# Altium schematic sheet PMIC.SchDoc
size A4; SheetNumber: 3; SheetTotal: 3
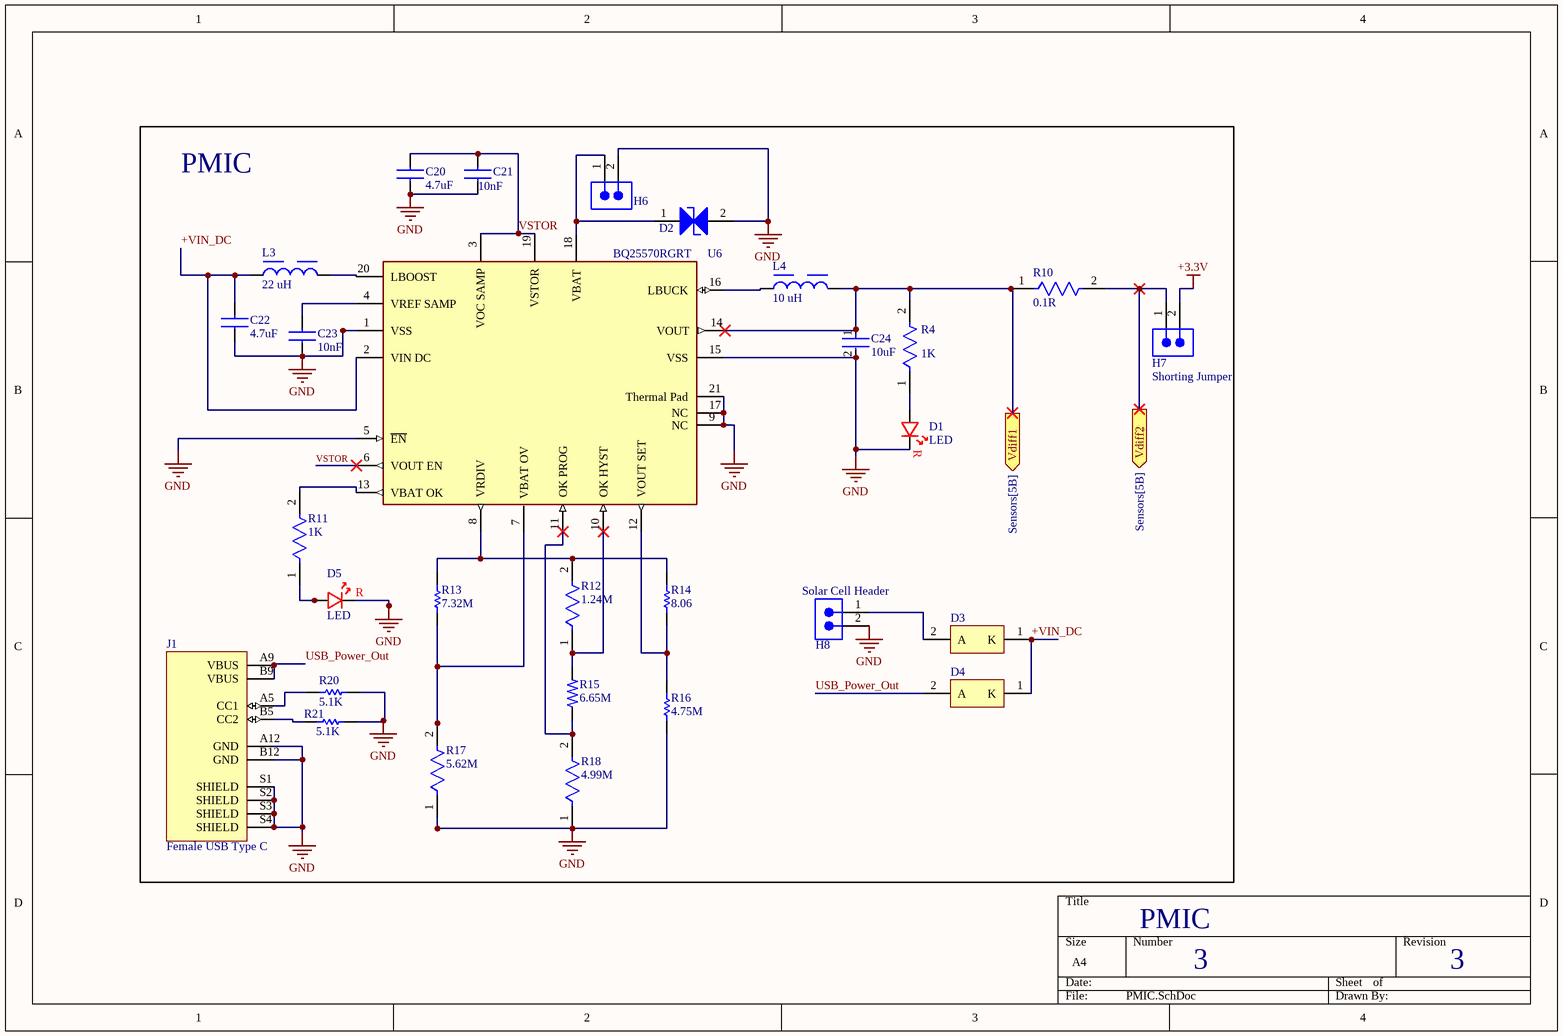
[diagram p0: PMIC.SchDoc]

## Parts
C20  4.7uF  [Cap_0603_4,7uf]
C21  10nF  [Cap_0603_10nF]
C22  4.7uF  [Cap_0603_4,7uf]
C23  10nF  [Cap_0603_10nF]
C24  10uF  [FP-GRM188-0_1-e0_2_0_55-IPC_A]
D1  LED  [LED_RED_1.6X0.8]
D2  824032815  [WE-TVS_DFN1610-2L]  (value not drawn)
D3  MBR120VLSFT1G  [ONSC-SOD-123FL-2-498-01_V]  (value not drawn)
D4  MBR120VLSFT1G  [ONSC-SOD-123FL-2-498-01_V]  (value not drawn)
D5  LED  [LED_RED_1.6X0.8]
H6  JST2PH  [JST_B2B-PH-K-S(LF)(SN)]  (value not drawn)
H7  Shorting Jumper  [2-PIN_MALE_HEADER_01-IN]
H8  Solar Cell Header  [2-PIN_MALE_HEADER_01-IN]
J1  Female USB Type C  [GCT_USB4125-GF-A_REVA2]
L3  22 uH  [WE-TPC_3816]
L4  10 uH  [WE-TPC_2813]
R4  1K  [FP-RMCF0805-IPC_C]
R10  0.1R  [FP-ERJ3R-MFG]
R11  1K  [FP-RMCF0805-IPC_C]
R12  1.24M  [FP-CRCW0805-e3-IPC_A]
R13  7.32M  [RESC0603(1608)_N]
R14  8.06  [RESC1609X50X30ML10T20]
R15  6.65M  [R_0603_6.65M]
R16  4.75M  [RESC1608X55X25ML10T15]
R17  5.62M  [FP-CRCW0603-e3-IPC_B]
R18  4.99M  [FP-AC0603-IPC_C]
R20  5.1K  [RESC1608X55X25ML10T15]
R21  5.1K  [RESC1608X55X25ML10T15]
U6  BQ25570RGRT  [BQ25570]

## Blocks framed on the sheet
PMIC: C20-C24 D1-D5 H6-H8 J1 L3 L4 R4 R10-R18 R20 R21 U6

## Ports
Vdiff1 (out, see Sensors[5B]), Vdiff2 (out, see Sensors[5B])

## Nets
+3.3V: H7.2
GND: C20.1 C21.1 C22.2 C23.2 C24.2 D1.C D2.2(GND) D5.C H6.2 H8.2 J1.A12(GND) J1.B12(GND) J1.S1(SHIELD) J1.S2(SHIELD) J1.S3(SHIELD) J1.S4(SHIELD) R16.1 R17.1 R18.1 R20.2 R21.2 U6.1(VSS) U6.5(~{EN}) U6.9(NC) U6.15(VSS) U6.17(NC) U6.21(Thermal_Pad)
+VIN_DC: C22.1 D3.1(K) D4.1(K) L3.1 U6.2(VIN_DC)
USB_Power_Out: D4.2(A) J1.A9(VBUS) J1.B9(VBUS)
Vdiff1: C24.1 L4.2 R4.2 R10.1 U6.14(VOUT) ; port Vdiff1
Vdiff2: H7.1 R10.2 ; port Vdiff2
VSTOR: C20.2 C21.2 U6.3(VOC_SAMP) U6.6(VOUT_EN) U6.19(VSTOR)
NetC23_1: C23.1 U6.4(VREF_SAMP)
NetD1_A: D1.A R4.1
NetD2_1: D2.1(I/O_1) H6.1 U6.18(VBAT)
NetD3_2: D3.2(A) H8.1
NetD5_A: D5.A R11.1
NetJ1_A5: J1.A5(CC1) R20.1
NetJ1_B5: J1.B5(CC2) R21.1
NetL3_2: L3.2 U6.20(LBOOST)
NetL4_1: L4.1 U6.16(LBUCK)
NetR11_2: R11.2 U6.13(VBAT_OK)
NetR12_1: R12.1 R15.2 U6.10(OK_HYST)
NetR12_2: R12.2 R13.2 R14.2 U6.8(VRDIV)
NetR13_1: R13.1 R17.2 U6.7(VBAT_OV)
NetR14_1: R14.1 R16.2 U6.12(VOUT_SET)
NetR15_1: R15.1 R18.2 U6.11(OK_PROG)

## Notes on the sheet
- PMIC
- 3
- (in symbol LED_1.6x0.8) R

## Library data of the parts
C20 C22 = Cap_0603_4.7uf: Ceramic Capacitor, Multilayer, Ceramic, 10V, 10% +Tol, 10% -Tol, X5R, 15% TC, 4.7uF, Surface Mount, 0603; Manufacturer: Samsung; Manufacturer Part Number: CL10A475KP8NNNC; Multilayer: Yes; Supplier: Digikey; Supplier Part Number: 1276-1044-1-ND; RoHS: Yes; Category: Ceramic Capacitors; Stock: 6782478; Pricing: 1=0.1, 10=0.041, 50=0.0234, 100=0.0182, 500=0.01368, 1000=0.01075, 4000=0.00899, 8000=0.00821, 12000=0.00782, 28000=0.00743, 100000=0.00537, 200000=0.0052, 400000=0.00489 (USD); Mounting Technology: Surface Mount; Pins: 2; Dielectric Material: Ceramic; Package Shape: Rectangular; Case/Package: 0603; Terminal Finish: Nickel; Min Operating Temperature: -55°C; Max Operating Temperature: 85°C; JESD-609 Code: e3; Value: 4.7uF; Capacitor Type: Ceramic; Tolerance  (fill in as +-): 10%; Package Style: SMTMeter; Packaging: Tape and Reel; Tolerance (fill in as +-): 10%; Rated DC Voltage (URdc): 10V; Temperature Characteristics Code: X5R; Termination: Wraparound; Length: 1.6mm; Width: 0.8mm; Height: 0.5mm; Reach SVHC Compliant: Yes; RoHS Compliant: Yes; ComponentLink1URL: https://datasheet.ciiva.com:443/pdfs/VipMasterIC/IC/SEMS/SEMS-S-A0008521003/SEMS-S-A0008520862-1.pdf?src-supplier=IHS+Markit; ComponentLink1Description: https://datasheet.ciiva.com:443/pdfs/VipMasterIC/IC/SEMS/SEMS-S-A0008521003/SEMS-S-A0008520862-1.pdf?src-supplier=IHS+Markit; ComponentLink2URL: https://datasheet.ciiva.com/25797/cl10a475kp8nnnc-25797520.pdf?src-supplier=Digikey; ComponentLink2Description: https://datasheet.ciiva.com/25797/cl10a475kp8nnnc-25797520.pdf?src-supplier=Digikey; ComponentLink3URL: https://datasheet.ciiva.com/26838/getdatasheetpartid-358676-26838384.pdf?src-supplier=Verical; ComponentLink3Description: https://datasheet.ciiva.com/26838/getdatasheetpartid-358676-26838384.pdf?src-supplier=Verical; ComponentLink4URL: https://datasheet.ciiva.com/16318/cl05b104kq5nnnc-16318245.pdf?src-supplier=Future+Electronics; ComponentLink4Description: https://datasheet.ciiva.com/16318/cl05b104kq5nnnc-16318245.pdf?src-supplier=Future+Electronics
C21 C23 = Cap_0603_10nF: Cap Cer 10NF 16V X7R 0603; Manufacturer: Samsung; Manufacturer Part Number: CL10B103KO8WPNC; Supplier: Digikey; Supplier Part Number: 1276-CL10B103KO8WPNCCT-ND; RoHS: No; Category: Ceramic Capacitors; Stock: 44818; Pricing: 1=0.1, 10=0.041, 50=0.0278, 100=0.0238, 500=0.01708, 1000=0.015 (USD)
C24 = CMP-2006-02792-2: Chip Multilayer Ceramic Capacitors for General Purpose, 0603, 10uF, X5R, 15%, 20%, 6.3V; Manufacturer: Murata; Manufacturer Part Number: GRM188R60J106ME47D; Multilayer: Yes; Packaging: Tape and Reel; Voltage Rating (DC): 6.3V; Width: 0.031inch; Termination: SMD/SMT; Dielectric: X5R; Package Quantity: 4000; Voltage Rating: 6.3V; Capacitance: 10uF; Case/Package: 0603; Min Operating Temperature: -55°C; Voltage: 6.3V; Length: 1.6mm; Thickness: 0.035inch; Lead Free: Lead Free; Depth: 0.8mm; Case Code (Imperial): 0603; Max Operating Temperature: 85°C; Material: Ceramic; Height: 0.8mm; Tolerance: 20%; Mount: Surface Mount; REACH SVHC: No SVHC; Radiation Hardening: No; Case Code (Metric): 1608; Supplier: Digikey; Supplier Part Number: 490-3896-1-ND; RoHS: Yes; Category: Ceramic Capacitors; Stock: 815910; Pricing: 1=0.15, 10=0.085, 50=0.059, 100=0.051, 500=0.03764, 1000=0.03346, 4000=0.02717, 8000=0.02481, 12000=0.02363, 20000=0.02231, 28000=0.02153, 40000=0.02079, 100000=0.01917, 200000=0.01819, 400000=0.01738 (USD); Mounting Technology: Surface Mount; Pins: 2; Dielectric Material: Ceramic; Package Shape: Rectangular; Terminal Finish: Nickel; JESD-609 Code: e3; Value: 10uF; Capacitor Type: Ceramic; Tolerance  (fill in as +-): 20%; Package Style: SMTMeter; Tolerance (fill in as +-): 20%; Rated DC Voltage (URdc): 6.3V; Temperature Characteristics Code: X5R; Reach SVHC Compliant: Yes; RoHS Compliant: Yes; ComponentLink1URL: https://datasheet.ciiva.com:443/pdfs/VipMasterIC/IC/MURE/MURE-S-A0008911298/MURE-S-A0008911290-1.pdf?src-supplier=IHS+Markit; ComponentLink1Description: https://datasheet.ciiva.com:443/pdfs/VipMasterIC/IC/MURE/MURE-S-A0008911298/MURE-S-A0008911290-1.pdf?src-supplier=IHS+Markit; ComponentLink2URL: https://datasheet.ciiva.com/22776/1747457-22776418.pdf?src-supplier=Farnell; ComponentLink2Description: https://datasheet.ciiva.com/22776/1747457-22776418.pdf?src-supplier=Farnell; ComponentLink3URL: https://datasheet.ciiva.com/29199/454401-da-01-en-vs-kondensator-0603-29199677.pdf?src-supplier=Conrad; ComponentLink3Description: https://datasheet.ciiva.com/29199/454401-da-01-en-vs-kondensator-0603-29199677.pdf?src-supplier=Conrad; ComponentLink4URL: https://datasheet.ciiva.com/29202/450781-da-01-de-vs-chip-kond-0603-10-0-uf-20pr-6-3v-x5r-29202806.pdf?src-supplier=Conrad; ComponentLink4Description: https://datasheet.ciiva.com/29202/450781-da-01-de-vs-chip-kond-0603-10-0-uf-20pr-6-3v-x5r-29202806.pdf?src-supplier=Conrad; ComponentLink5URL: https://datasheet.ciiva.com/138/partnumbering-e-01-138658.pdf?src-supplier=Digikey; ComponentLink5Description: https://datasheet.ciiva.com/138/partnumbering-e-01-138658.pdf?src-supplier=Digikey; ComponentLink6URL: https://datasheet.ciiva.com/138/partnumbering-e-01-138659.pdf?src-supplier=Digikey; ComponentLink6Description: https://datasheet.ciiva.com/138/partnumbering-e-01-138659.pdf?src-supplier=Digikey; ComponentLink7URL: https://datasheet.ciiva.com/138/partnumbering-e-01-138660.pdf?src-supplier=Digikey; ComponentLink7Description: https://datasheet.ciiva.com/138/partnumbering-e-01-138660.pdf?src-supplier=Digikey
D1 D5 = LED_1.6x0.8: LED Low-Power Uni-Color Red 630nm 2V 2-Pin Chip 0603(1608Metric) T/R; Manufacturer: Wurth Electronics; Manufacturer Part Number: 150060RS75000; Lens Color: Colorless; Viewing Angle: 140°; Lens Style: Clear,Flat,Rectangular; Luminous Intensity: 250mcd; Forward Current: 30mA; Wavelength: 625nm; Test Current: 20mA; Lens Transparency: Clear; Max Reverse Voltage (DC): 5V; Power Dissipation: 72mW; Lens Size: 0.7mm; Supplier: Digikey; Supplier Part Number: 732-4978-1-ND; RoHS: Yes; Category: LEDs; Stock: 135692; Pricing: 1=0.15, 50=0.142, 100=0.122, 500=0.105, 1000=0.10125 (USD); Mounting Technology: Surface Mount; Case/Package: 0603; Color: Red; Case Code (Metric): 1608; Case Code (Imperial): 0603; Min Operating Temperature: -40°C; Max Operating Temperature: 85°C; Package Quantity: 1; Packaging: Cut Tape; Forward Voltage: 2V; Dominant Wavelength: 625nm; Series: WL-SMCW; Reverse Voltage: 5V; Length: 1.6mm; Width: 0.8mm; Height: 0.8mm; RoHS Compliant: Yes; Reach SVHC Compliant: Unknown; ComponentLink1URL: https://datasheet.ciiva.com/29563/150060rs75000-29563040.pdf?src-supplier=Digikey; ComponentLink1Description: https://datasheet.ciiva.com/29563/150060rs75000-29563040.pdf?src-supplier=Digikey
D2 = CMP-03913-133963841-1: 824032815 Tvs Diode, Bidir, 5V, Dfn1610 Rohs Compliant: Yes; Manufacturer: Wurth Electronics; Min Operating Temperature: -55°C; Width: 1mm; NexarPartId: 133963841; Length: 1.6mm; RoHS: Compliant; Max Operating Temperature: 85°C; Height: 500µm; Supplier: Digikey; Supplier Part Number: 732-824032815CT-ND; Manufacturer Part Number: 824032815; Category: Fixed Inductors; Stock: 7960; Pricing: 1=1.19, 50=1.078, 100=1.012, 250=0.923 (USD); Reach SVHC Compliant: Yes; RoHS Compliant: Yes; ComponentLink1URL: https://datasheet.octopart.com/824032815-Wurth-Elektronik-datasheet-168501706.pdf?src-supplier=Newark; ComponentLink1Description: https://datasheet.octopart.com/824032815-Wurth-Elektronik-datasheet-168501706.pdf?src-supplier=Newark
D3 D4 = CMP-1055-00449-1: Schottky Power Rectifier, 2-Pin SOD-123, Pb-Free, Tape and Reel; Manufacturer: On Semiconductor; IFSM Max (A): 45; Configuration: Single; Diode Element Material: SILICON; Package Body Material: Plastic; Additional Feature: FREE WHEELING DIODE; Forward Voltage: 205mV; Non-rep Pk Forward Current-Max: 45A; Number of Elements: 1; Max Output current: 1A; Rep Pk Reverse Voltage-Max: 20V; Time @ Peak Reflow Temperature-Max (s): 40s; Qualification Status: Not Qualified; PackageDescription: 2-Pin SOD, Body 1.65 x 2.7 mm; RoHS: TRUE; ComponentLink2URL: http://www.onsemi.cn/pub_link/Collateral/MBR120VLSFT1-D.PDF; Mounting Technology: Surface Mount; ComponentLink1Description: Manufacturer URL; DatasheetVersion: Rev. 2; ComponentLink3Description: Package Specification; Packing: Tape and Reel; ComponentLink2Description: Datasheet; ComponentLink1URL: http://www.onsemi.com/; PackageVersion: Rev. A; PackageReference: SOD-123FL-2-498-01; ComponentLink3URL: http://www.onsemi.cn/pub_link/Collateral/MBR120VLSFT1-D.PDF; PartNumber: MBR120VLSFT1G; Supplier: Digikey; Supplier Part Number: MBR120VLSFT1GOSCT-ND; Manufacturer Part Number: MBR120VLSFT1G; Category: Schottky Diodes; Stock: 7907; Pricing: 1=0.41, 10=0.278, 100=0.1876, 500=0.1458, 1000=0.13191, 3000=0.11394, 6000=0.10475, 9000=0.10004, 15000=0.09471, 21000=0.09154, 30000=0.08925 (USD); Pins: 2; Package Shape: Rectangular; Terminal Finish: Tin; Min Operating Temperature: -65°C; Max Operating Temperature: 125°C; JESD-609 Code: e3; Diode Type: RECTIFIER; JESD-30 Code: R-PDSO-F2; Moisture Sensitivity Level: 1; Package Style: SMALL OUTLINEMeter; Peak Reflow Temperature (Cel): 260°C; Surface Mount: Yes; Technology: SCHOTTKY; Terminal Form: Flat; Terminal Position: DUAL; RoHS Compliant: Yes; Reach SVHC Compliant: No; ComponentLink4URL: https://datasheet.ciiva.com:443/pdfs/VipMasterIC/IC/ONSM/ONSM-S-A0000042174/ONSM-S-A0000042174-1.pdf?src-supplier=IHS+Markit; ComponentLink4Description: https://datasheet.ciiva.com:443/pdfs/VipMasterIC/IC/ONSM/ONSM-S-A0000042174/ONSM-S-A0000042174-1.pdf?src-supplier=IHS+Markit; ComponentLink5URL: https://datasheet.ciiva.com/7962/85900-7962720.pdf?src-supplier=Element14; ComponentLink5Description: https://datasheet.ciiva.com/7962/85900-7962720.pdf?src-supplier=Element14; ComponentLink6URL: https://datasheet.ciiva.com/915/mbr120vlsft1-d-915659.pdf?src-supplier=Digikey; ComponentLink6Description: https://datasheet.ciiva.com/915/mbr120vlsft1-d-915659.pdf?src-supplier=Digikey; ComponentLink7URL: https://datasheet.ciiva.com/915/mbr120vlsft1-d-915660.pdf?src-supplier=Digikey; ComponentLink7Description: https://datasheet.ciiva.com/915/mbr120vlsft1-d-915660.pdf?src-supplier=Digikey; ComponentLink8URL: https://datasheet.ciiva.com/18435/70100467-18435526.pdf?src-supplier=Allied+Electronics; ComponentLink8Description: https://datasheet.ciiva.com/18435/70100467-18435526.pdf?src-supplier=Allied+Electronics; ComponentLink9URL: https://datasheet.ciiva.com/16392/mbr120vlsft1-d-16392906.pdf?src-supplier=Future+Electronics; ComponentLink9Description: https://datasheet.ciiva.com/16392/mbr120vlsft1-d-16392906.pdf?src-supplier=Future+Electronics
H6 = JST2PH: Connector Header Through Hole 2 position 0.079" (2.00mm); Manufacturer: JST; Manufacturer Part Number: B2B-PH-K-S; Supplier: Digi-Key; Supplier Part Number: 455-1704-ND; RoHS: Yes; Category: Connectors; Stock: 1077617; Pricing: 1=0.19, 10=0.147, 100=0.1088, 500=0.09006, 1000=0.0788, 5000=0.06754, 10000=0.06567 (USD); ComponentLink1URL: https://datasheet.ciiva.com/6905/phseries-6905929.pdf?src-supplier=Digi-Key; ComponentLink1Description: https://datasheet.ciiva.com/6905/phseries-6905929.pdf?src-supplier=Digi-Key
H7 H8 = PRPC002SAAN-RC: CONN HEADER VERT 2POS 2.54MM; Manufacturer: Sullins; Connector Type: Header, Unshrouded, Breakaway; Number of Positions: 2; Number of Positions Loaded: All; Pitch: 0.100" (2.54mm); Online Catalog: 0.100" (2.54mm) Pitch Connector Headers; Other Names: S9510E-02  S9510E-02-ND; Supplier 1: Digi-Key; Manufacturer Part Number: PRPC002SAAN-RC; Stock 1: 42739; Pricing 1: 1=0.08, 10=0.073, 25=0.054, 50=0.0464, 100=0.0449, 250=0.0387, 500=0.0372 (USD); Standard Package: 1; Category: Connectors, Interconnects; Family: Rectangular Connectors - Headers, Male Pins; Series: -; Packaging: Bulk; Contact Type: Male Pin; Number of Rows: 1; Row Spacing: -; Contact Mating Length: 0.230" (5.84mm); Mounting Type: Through Hole; Termination: Solder; Fastening Type: -; Features: -; Contact Finish: Gold; Contact Finish Thickness: Flash; Color: Black; ComponentLink1URL: https://media.digikey.com/PDF/Data%20Sheets/Sullins%20PDFs/xRxCzzzSxxN-RC_ST_11635-B.pdf?src-supplier=Digi-Key; ComponentLink1Description: https://media.digikey.com/PDF/Data%20Sheets/Sullins%20PDFs/xRxCzzzSxxN-RC_ST_11635-B.pdf?src-supplier=Digi-Key; Supplier Part Number 1: S1011EC-02-ND
J1 = USB-C Power Connector: USB Connector, 24 Contact(s), Female, Right Angle, Solder Terminal, Locking, Receptacle; Manufacturer Part Number: USB4125-GF-A_REVA2; Manufacturer: Global Connector Technology; Package: None; Availability: Unavailable; Value: *; Price: None; Supplier: Digikey; Supplier Part Number: 2073-USB4125-GF-ACT-ND; RoHS: No; Category: Connectors; Stock: 7054; Pricing: 1=0.81, 10=0.61, 25=0.5468, 50=0.5044, 100=0.4657, 250=0.42028, 500=0.38968 (USD); ComponentLink1URL: https://datasheet.octopart.com/USB4125-GF-A-Global-Connector-Technology-datasheet-148864632.pdf?src-supplier=Future+Electronics; ComponentLink1Description: https://datasheet.octopart.com/USB4125-GF-A-Global-Connector-Technology-datasheet-148864632.pdf?src-supplier=Future+Electronics; ComponentLink2URL: https://datasheet.octopart.com/USB4125-GF-A-GCT-datasheet-166929326.pdf?src-supplier=SOS+electronic; ComponentLink2Description: https://datasheet.octopart.com/USB4125-GF-A-GCT-datasheet-166929326.pdf?src-supplier=SOS+electronic
L3 = CMP-0227-00346-4: NexarPartId: 22866169; Manufacturer: Wurth Electronics; Manufacturer Part Number: 744031220; Series Resistance: 450mΩ; Self Resonant Frequency: 26MHz; Core Material: Ferrite; Current Rating: 510mA; Test Frequency: 100kHz; Tolerance: 30%; Saturation Current: 360mA; Inductance: 22µH; DC Resistance (DCR): 410mΩ; Case/Size Code: 1515; Inductance-Nom (L): 22uH; Inductor Application: POWER INDUCTOR; Inductor Type: GENERAL PURPOSE INDUCTOR; Channels: 1; Shape/Size Description: RECTANGULAR PACKAGE; Shielding: Unshielded; Package Height: 1.65mm; Package Length: 3.8mm; Width: 3.8mm; Ambient Temperature Range High: 95°C; Number of Pins: 2; Ambient Temperature Range Low: -40°C; Min Operating Temperature: -40°C; Packaging: Tape & Reel (TR); Height: 1.65mm; RoHS: Compliant; Composition: Wirewound; RMS Current (Irms): 510mA; Max Operating Temperature: 125°C; Inductance Tolerance: 30%; Length: 3.8mm; Supplier: Digikey; Supplier Part Number: 732-1012-1-ND; Category: Fixed Inductors; Stock: 7284; Pricing: 1=1.52, 10=1.481, 50=1.296, 100=1.185, 500=1.044 (USD); Pins: 2; Terminal Finish: Tin; JESD-609 Code: e3; Construction: Chip; Package Style: SMTMeter; Max Current Rating: 510mA; Surface Mount: Yes; Terminal Placement: Dual Ended; Termination: One Surface; Package Width: 3.8mm; Reach SVHC Compliant: Yes; RoHS Compliant: Yes; ComponentLink1URL: https://datasheet.ciiva.com:443/pdfs/VipMasterIC/IC/MIDC/MIDC-S-A0002802410/MIDC-S-A0002802381-1.pdf?src-supplier=IHS+Markit; ComponentLink1Description: https://datasheet.ciiva.com:443/pdfs/VipMasterIC/IC/MIDC/MIDC-S-A0002802410/MIDC-S-A0002802381-1.pdf?src-supplier=IHS+Markit; ComponentLink2URL: https://datasheet.ciiva.com/4961/744031220-79613-4961173.pdf?src-supplier=Mouser; ComponentLink2Description: https://datasheet.ciiva.com/4961/744031220-79613-4961173.pdf?src-supplier=Mouser; ComponentLink3URL: https://datasheet.ciiva.com/11800/0900766b8079f7b9-11800353.pdf?src-supplier=Rs; ComponentLink3Description: https://datasheet.ciiva.com/11800/0900766b8079f7b9-11800353.pdf?src-supplier=Rs; ComponentLink4URL: https://datasheet.ciiva.com/7210/744031220-7210946.pdf?src-supplier=Newark; ComponentLink4Description: https://datasheet.ciiva.com/7210/744031220-7210946.pdf?src-supplier=Newark; ComponentLink5URL: https://datasheet.ciiva.com/1058/744031220-1058566.pdf?src-supplier=Digikey; ComponentLink5Description: https://datasheet.ciiva.com/1058/744031220-1058566.pdf?src-supplier=Digikey; ComponentLink6URL: https://datasheet.ciiva.com/1058/744031220-1058567.pdf?src-supplier=Digikey; ComponentLink6Description: https://datasheet.ciiva.com/1058/744031220-1058567.pdf?src-supplier=Digikey; ComponentLink7URL: https://datasheet.ciiva.com/14123/lp744031220-data-de-14123802.pdf?src-supplier=Distrelec; ComponentLink7Description: https://datasheet.ciiva.com/14123/lp744031220-data-de-14123802.pdf?src-supplier=Distrelec; ComponentLink8URL: https://datasheet.ciiva.com/7691/744031220-7691543.pdf?src-supplier=Element14; ComponentLink8Description: https://datasheet.ciiva.com/7691/744031220-7691543.pdf?src-supplier=Element14
L4 = CMP-0227-00077-3: NexarPartId: 8917062; Manufacturer: Wurth Electronics; Manufacturer Part Number: 744029100; Tolerance: 30%; Saturation Current: 500mA; Series Resistance: 300mΩ; Shielding: Shielded; Core Material: Ferrite; Resistance: 390mΩ; Max DC Current: 800mA; Inductance: 10µH; Self Resonant Frequency: 40MHz; Test Frequency: 100kHz; RMS Current (Irms): 650mA; Case/Size Code: 1111; Inductance-Nom (L): 10uH; Inductor Application: POWER INDUCTOR; Inductor Type: GENERAL PURPOSE INDUCTOR; Channels: 1; Max Current Rating: 750mA; Shape/Size Description: RECTANGULAR PACKAGE; Package Height: 1.35mm; Package Length: 2.8mm; Min Operating Temperature: -40°C; Mount: Surface Mount; Height - Seated (Max): 1.4986mm; Width: 2.78mm; Number of Pins: 2; Ambient Temperature Range High: 85°C; Lead Free: Lead Free; Case/Package: Nonstandard; Weight: 32.006612mg; REACH SVHC: Unknown; Depth: 2.8mm; Height: 1.35mm; Length: 2.78mm; RoHS: Compliant; Max Operating Temperature: 125°C; DC Resistance (DCR): 390mΩ; Inductance Tolerance: 30%; Composition: Wirewound; Current Rating: 650mA; Ambient Temperature Range Low: -40°C; Termination: SMD/SMT; Packaging: Cut Tape (CT); Supplier: Digikey; Supplier Part Number: 732-1091-1-ND; Category: Fixed Inductors; Stock: 27878; Pricing: 1=1.5, 10=1.36, 50=1.18, 100=1.11, 500=1.02 (USD); Pins: 2; Terminal Finish: Tin; JESD-609 Code: e3; Construction: Chip; Package Style: SMTMeter; Surface Mount: Yes; Terminal Placement: Dual Ended; Package Width: 2.8mm; Reach SVHC Compliant: Yes; RoHS Compliant: Yes; ComponentLink1URL: https://datasheet.ciiva.com:443/pdfs/VipMasterIC/IC/MIDC/MIDC-S-A0002801410/MIDC-S-A0002801335-1.pdf?src-supplier=IHS+Markit; ComponentLink1Description: https://datasheet.ciiva.com:443/pdfs/VipMasterIC/IC/MIDC/MIDC-S-A0002801410/MIDC-S-A0002801335-1.pdf?src-supplier=IHS+Markit; ComponentLink2URL: https://datasheet.ciiva.com/6700/744029100-6700264.pdf?src-supplier=Digikey; ComponentLink2Description: https://datasheet.ciiva.com/6700/744029100-6700264.pdf?src-supplier=Digikey; ComponentLink3URL: https://datasheet.ciiva.com/5975/69360-5975061.pdf?src-supplier=Farnell; ComponentLink3Description: https://datasheet.ciiva.com/5975/69360-5975061.pdf?src-supplier=Farnell; ComponentLink4URL: https://datasheet.ciiva.com/11802/0900766b80d7f1cc-11802020.pdf?src-supplier=Rs; ComponentLink4Description: https://datasheet.ciiva.com/11802/0900766b80d7f1cc-11802020.pdf?src-supplier=Rs; ComponentLink5URL: https://datasheet.ciiva.com/4961/744029100-81254-4961409.pdf?src-supplier=Mouser; ComponentLink5Description: https://datasheet.ciiva.com/4961/744029100-81254-4961409.pdf?src-supplier=Mouser; ComponentLink6URL: https://datasheet.ciiva.com/6700/744029100-6700266.pdf?src-supplier=Digikey; ComponentLink6Description: https://datasheet.ciiva.com/6700/744029100-6700266.pdf?src-supplier=Digikey; ComponentLink7URL: https://datasheet.ciiva.com/7892/69360-7892549.pdf?src-supplier=Element14; ComponentLink7Description: https://datasheet.ciiva.com/7892/69360-7892549.pdf?src-supplier=Element14; ComponentLink8URL: https://datasheet.ciiva.com/22702/69360-22702631.pdf?src-supplier=Element14; ComponentLink8Description: https://datasheet.ciiva.com/22702/69360-22702631.pdf?src-supplier=Element14
R4 R11 = CMP-26527-002331-1: 1kΩ ±1% 0.125W 0805 Thick Film Chip Resistor AEC-Q200 compliant; Manufacturer: Stackpole Electronics; Manufacturer Part Number: RMCF0805FT1K00; Resistance: 1kR; Max Power Dissipation: 125mW; Temperature Coefficient: 100ppm/°C; Rated Temperature: 70°C; Value: 1kR; Working Voltage: 150V; Package Height: 0.5mm; Package Length: 2mm; Package Width: 1.25mm; Contact Plating: Tin; Case Code (Imperial): 0805; Radiation Hardening: No; Case/Package: 0805; Min Operating Temperature: -55°C; Construction: Rectangular; Tolerance: 1%; Length: 2mm; Features: Automotive AEC-Q200; Height: 0.026inch; Mount: Surface Mount; Series: RMCF; Number of Terminations: 2; Width: 0.049inch; Packaging: Tape and Reel; Size Code: 0805; Lead Free: Lead Free; Depth: 1.25mm; Power Rating: 125mW; Resistor Type: Thick Film; Case Code (Metric): 2012; Military Standard: Not; Max Operating Temperature: 155°C; RoHS Compliant: Yes; Supplier: Digikey; Supplier Part Number: RMCF0805FT1K00CT-ND; RoHS: Yes; Category: Chip SMD Resistors; Stock: 390730; Pricing: 1=0.1, 10=0.021, 50=0.0126, 100=0.0104, 500=0.00696, 1000=0.00594, 5000=0.00428, 10000=0.00379, 15000=0.00354, 25000=0.00328, 35000=0.00312, 50000=0.00297, 125000=0.00265, 250000=0.00246, 500000=0.00231 (USD); Mounting Technology: Surface Mount; Pins: 2; Package Shape: Rectangular; Terminal Finish: Nickel; JESD-609 Code: e3; Power: 125mW; Technology: METAL GLAZE/THICK FILM; Termination: Wraparound; Reference Standard: AEC-Q200; Reach SVHC Compliant: Yes; ComponentLink1URL: https://datasheet.ciiva.com:443/pdfs/VipMasterIC/IC/SEIE/SEIE-S-A0009541969/SEIE-S-A0009541969-1.pdf?src-supplier=IHS+Markit; ComponentLink1Description: https://datasheet.ciiva.com:443/pdfs/VipMasterIC/IC/SEIE/SEIE-S-A0009541969/SEIE-S-A0009541969-1.pdf?src-supplier=IHS+Markit; ComponentLink2URL: https://datasheet.ciiva.com/15193/getdatasheetpartid-360136-15193546.pdf?src-supplier=Verical; ComponentLink2Description: https://datasheet.ciiva.com/15193/getdatasheetpartid-360136-15193546.pdf?src-supplier=Verical
R10 = CMP-2000-00862-2: RES 0.1 OHM 1% 1/10W 0603; Manufacturer: Panasonic; Manufacturer Part Number: ERJ-3RSFR10V; Resistance: 100mR; Power Rating: 100mW; Temperature Coefficient: 300ppm/°C; Rated Temperature: 70°C; Value: 100mR; Package Height: 0.45mm; Package Length: 1.6mm; Package Width: 0.8mm; Reference Standard: AEC-Q200; Termination: SMD/SMT; Height: 0.45mm; Tolerance: 1%; Resistor Type: Thick Film; Package Quantity: 5000; Case/Package: 0603; Case Code (Metric): 1608; Lead Free: Lead Free; Military Standard: Not; Min Operating Temperature: -55°C; Construction: Rectangular; Resistance Tolerance: 1%; REACH SVHC: No SVHC; RoHS Compliant: Yes; Series: ERJ; Number of Terminations: 2; Number of Pins: 2; Length: 1.6mm; Mount: Surface Mount; Max Power Dissipation: 100mW; Width: 0.031inch; Case Code (Imperial): 0603; Contact Plating: Tin; Packaging: Tape and Reel; Radiation Hardening: No; Size Code: 0603; Technology: THICK FILM; Max Operating Temperature: 125°C; Depth: 0.8mm; Supplier: Digikey; Supplier Part Number: P.10AJCT-ND; RoHS: Yes; Category: Chip SMD Resistors; Stock: 158831; Pricing: 1=0.23, 10=0.128, 25=0.1028, 50=0.0872, 100=0.0744, 250=0.06076, 500=0.0524, 1000=0.04545 (USD); Mounting Technology: Surface Mount; Pins: 2; Package Shape: Rectangular; Terminal Finish: Nickel; JESD-609 Code: e3; Power: 100mW; Reach SVHC Compliant: Yes; ComponentLink1URL: https://datasheet.ciiva.com:443/pdfs/VipMasterIC/IC/PANA/PANA-S-A0009615198/PANA-S-A0009615198-1.pdf?src-supplier=IHS+Markit; ComponentLink1Description: https://datasheet.ciiva.com:443/pdfs/VipMasterIC/IC/PANA/PANA-S-A0009615198/PANA-S-A0009615198-1.pdf?src-supplier=IHS+Markit
R12 = CMP-1013-00859-2: RES Thick Film, 1.24MΩ, 1%, 0.125W, 100ppm/°C, 0805; Manufacturer: Vishay; Manufacturer Part Number: CRCW08051M24FKEA; Max Power Dissipation: 125mW; Voltage Rating (DC): 150V; Resistance: 1.24MR; Rated Temperature: 70°C; Value: 1.24MR; Package Height: 0.45mm; Package Length: 2mm; Package Width: 1.25mm; Reference Standard: AEC-Q200; Max Operating Temperature: 155°C; Case Code (Imperial): 0805; Case/Package: 0805; Temperature Coefficient: 100ppm/°C; Packaging: Tape and Reel; Tolerance: 1%; Voltage Rating: 150V; Military Standard: Not; Lead Free: Lead Free; Length: 2mm; Contact Plating: Tin; Package Quantity: 10; Depth: 1.25mm; Weight: 0.000194oz; Height: 0.45mm; Height - Seated (Max): 0.02inch; Number of Terminations: 2; Width: 0.049inch; Radiation Hardening: No; Min Operating Temperature: -55°C; Features: Automotive AEC-Q200; Number of Pins: 2; Case Code (Metric): 2012; Power Rating: 125mW; Composition: Thick Film; Supplier: Digikey; Supplier Part Number: 541-1.24MCCT-ND; RoHS: Yes; Category: Chip SMD Resistors; Stock: 32258; Pricing: 1=0.1, 10=0.038, 50=0.0248, 100=0.021, 500=0.01462, 1000=0.01273 (USD); Mounting Technology: Surface Mount; Pins: 2; Package Shape: Rectangular; Terminal Finish: Nickel; JESD-609 Code: e3; Resistor Type: FIXED RESISTOR; Construction: Chip; Package Style: SMTMeter; Power: 125mW; Technology: METAL GLAZE/THICK FILM; Termination: Wraparound; Working Voltage: 150V; Reach SVHC Compliant: Yes; RoHS Compliant: Yes; ComponentLink1URL: https://datasheet.ciiva.com:443/pdfs/VipMasterIC/IC/VISH/VISH-S-A0007266705/VISH-S-A0007266705-1.pdf?src-supplier=IHS+Markit; ComponentLink1Description: https://datasheet.ciiva.com:443/pdfs/VipMasterIC/IC/VISH/VISH-S-A0007266705/VISH-S-A0007266705-1.pdf?src-supplier=IHS+Markit; ComponentLink2URL: https://datasheet.ciiva.com/2496/dcrcwe3-2496064.pdf?src-supplier=Digikey; ComponentLink2Description: https://datasheet.ciiva.com/2496/dcrcwe3-2496064.pdf?src-supplier=Digikey; ComponentLink3URL: https://datasheet.ciiva.com/2496/dcrcwe3-2496065.pdf?src-supplier=Digikey; ComponentLink3Description: https://datasheet.ciiva.com/2496/dcrcwe3-2496065.pdf?src-supplier=Digikey; ComponentLink4URL: https://datasheet.ciiva.com/2496/dcrcwe3-2496066.pdf?src-supplier=Digikey; ComponentLink4Description: https://datasheet.ciiva.com/2496/dcrcwe3-2496066.pdf?src-supplier=Digikey; ComponentLink5URL: https://datasheet.ciiva.com/9104/dcrcwe3-9104807.pdf?src-supplier=Avnet; ComponentLink5Description: https://datasheet.ciiva.com/9104/dcrcwe3-9104807.pdf?src-supplier=Avnet; ComponentLink6URL: https://datasheet.ciiva.com/5577/dcrcwe3-109170-5577389.pdf?src-supplier=Mouser; ComponentLink6Description: https://datasheet.ciiva.com/5577/dcrcwe3-109170-5577389.pdf?src-supplier=Mouser
R13 = CMP-1012-00947-1: 7M32 0.1W 1% 0603 (1608 Metric)  SMD; Manufacturer: Vishay; Manufacturer Part Number: CRCW06037M32FKEA; Case-Metric: 1608; Value: 7320000.00 Ohm; Case-EIA: 0603; Rated Temperature: 70°C; Temperature Coefficient: 100ppm/°C; Working Voltage: 75V; Package Height: 0.45mm; Package Length: 1.55mm; Package Width: 0.85mm; Reference Standard: AEC-Q200; Technology: SMT; Power: 0.1 W; Tolerance: 1 %; Supplier: Digikey; Supplier Part Number: 541-7.32MHCT-ND; RoHS: Yes; Category: Chip SMD Resistors; Stock: 18600; Pricing: 1=0.1, 10=0.026, 50=0.0166, 100=0.014, 500=0.00954, 1000=0.00824 (USD); Mounting Technology: Surface Mount; Pins: 2; Package Shape: Rectangular; Case/Package: 0603; Terminal Finish: Nickel; Min Operating Temperature: -55°C; Max Operating Temperature: 155°C; JESD-609 Code: e3; Resistor Type: FIXED RESISTOR; Construction: Chip; Package Style: SMTMeter; Packaging: Tape and Reel; Termination: Wraparound; Reach SVHC Compliant: Yes; RoHS Compliant: Yes; ComponentLink1URL: https://datasheet.ciiva.com:443/pdfs/VipMasterIC/IC/VISH/VISH-S-A0007266705/VISH-S-A0007266705-1.pdf?src-supplier=IHS+Markit; ComponentLink1Description: https://datasheet.ciiva.com:443/pdfs/VipMasterIC/IC/VISH/VISH-S-A0007266705/VISH-S-A0007266705-1.pdf?src-supplier=IHS+Markit; ComponentLink2URL: https://datasheet.ciiva.com/22676/1700796-22676479.pdf?src-supplier=Element14; ComponentLink2Description: https://datasheet.ciiva.com/22676/1700796-22676479.pdf?src-supplier=Element14; ComponentLink3URL: https://datasheet.ciiva.com/5588/dcrcwe3-109170-5588998.pdf?src-supplier=Mouser; ComponentLink3Description: https://datasheet.ciiva.com/5588/dcrcwe3-109170-5588998.pdf?src-supplier=Mouser; ComponentLink4URL: https://datasheet.ciiva.com/2525/dcrcwe3-2525464.pdf?src-supplier=Digikey; ComponentLink4Description: https://datasheet.ciiva.com/2525/dcrcwe3-2525464.pdf?src-supplier=Digikey; ComponentLink5URL: https://datasheet.ciiva.com/2525/dcrcwe3-2525465.pdf?src-supplier=Digikey; ComponentLink5Description: https://datasheet.ciiva.com/2525/dcrcwe3-2525465.pdf?src-supplier=Digikey; ComponentLink6URL: https://datasheet.ciiva.com/2525/dcrcwe3-2525466.pdf?src-supplier=Digikey; ComponentLink6Description: https://datasheet.ciiva.com/2525/dcrcwe3-2525466.pdf?src-supplier=Digikey
R14 = CMP-2000-03628-1: Manufacturer: Vishay Dale; Part Number: CRCW06038M06FKEA; Tolerance: 1%; Power: 100mW; Rated Temperature: 70°C; Value: 8.06MR; Temperature Coefficient: 100ppm/°C; Working Voltage: 75V; Package Height: 0.45mm; Package Length: 1.55mm; Package Width: 0.85mm; Reference Standard: AEC-Q200; Supplier: Digikey; Supplier Part Number: 541-8.06MHCT-ND; Manufacturer Part Number: CRCW06038M06FKEA; RoHS: Yes; Category: Chip SMD Resistors; Stock: 18875; Pricing: 1=0.1, 10=0.026, 50=0.0166, 100=0.014, 500=0.00954, 1000=0.00824 (USD); Mounting Technology: Surface Mount; Pins: 2; Package Shape: Rectangular; Case/Package: 0603; Terminal Finish: Nickel; Min Operating Temperature: -55°C; Max Operating Temperature: 155°C; JESD-609 Code: e3; Resistor Type: FIXED RESISTOR; Construction: Chip; Package Style: SMTMeter; Packaging: Tape and Reel; Technology: METAL GLAZE/THICK FILM; Termination: Wraparound; Reach SVHC Compliant: Yes; RoHS Compliant: Yes; ComponentLink1URL: https://datasheet.ciiva.com:443/pdfs/VipMasterIC/IC/VISH/VISH-S-A0007266705/VISH-S-A0007266705-1.pdf?src-supplier=IHS+Markit; ComponentLink1Description: https://datasheet.ciiva.com:443/pdfs/VipMasterIC/IC/VISH/VISH-S-A0007266705/VISH-S-A0007266705-1.pdf?src-supplier=IHS+Markit; ComponentLink2URL: https://datasheet.ciiva.com/3257/dcrcwe3-3257960.pdf?src-supplier=Avnet; ComponentLink2Description: https://datasheet.ciiva.com/3257/dcrcwe3-3257960.pdf?src-supplier=Avnet; ComponentLink3URL: https://datasheet.ciiva.com/2525/dcrcwe3-2525443.pdf?src-supplier=Digikey; ComponentLink3Description: https://datasheet.ciiva.com/2525/dcrcwe3-2525443.pdf?src-supplier=Digikey; ComponentLink4URL: https://datasheet.ciiva.com/2525/dcrcwe3-2525444.pdf?src-supplier=Digikey; ComponentLink4Description: https://datasheet.ciiva.com/2525/dcrcwe3-2525444.pdf?src-supplier=Digikey; ComponentLink5URL: https://datasheet.ciiva.com/2525/dcrcwe3-2525445.pdf?src-supplier=Digikey; ComponentLink5Description: https://datasheet.ciiva.com/2525/dcrcwe3-2525445.pdf?src-supplier=Digikey; ComponentLink6URL: https://datasheet.ciiva.com/22676/1700796-22676839.pdf?src-supplier=Element14; ComponentLink6Description: https://datasheet.ciiva.com/22676/1700796-22676839.pdf?src-supplier=Element14; ComponentLink7URL: https://datasheet.ciiva.com/5561/dcrcwe3-109170-5561990.pdf?src-supplier=Mouser; ComponentLink7Description: https://datasheet.ciiva.com/5561/dcrcwe3-109170-5561990.pdf?src-supplier=Mouser; ComponentLink8URL: https://datasheet.ciiva.com/16771/70201119-16771839.pdf?src-supplier=Allied+Electronics; ComponentLink8Description: https://datasheet.ciiva.com/16771/70201119-16771839.pdf?src-supplier=Allied+Electronics; ComponentLink9URL: https://datasheet.ciiva.com/7748/1697337-7748713.pdf?src-supplier=Element14; ComponentLink9Description: https://datasheet.ciiva.com/7748/1697337-7748713.pdf?src-supplier=Element14; ComponentLink10URL: https://datasheet.ciiva.com/7748/1697337-7748714.pdf?src-supplier=Element14; ComponentLink10Description: https://datasheet.ciiva.com/7748/1697337-7748714.pdf?src-supplier=Element14; ComponentLink11URL: https://datasheet.ciiva.com/7792/1700796-7792430.pdf?src-supplier=Element14; ComponentLink11Description: https://datasheet.ciiva.com/7792/1700796-7792430.pdf?src-supplier=Element14
R15 = CRCW06036M65FKEA: Fixed Resistor, Metal Glaze/thick Film, 0.1W, 6650000ohm, 75V, 1% +/-Tol, 100ppm/Cel, Surface Mount, 0603; Manufacturer: Vishay; Power: 100mW; Rated Temperature: 70°C; Value: 6.65MR; Temperature Coefficient: 100ppm/°C; Package Height: 0.45mm; Package Length: 1.55mm; Package Width: 0.85mm; Reference Standard: AEC-Q200; Supplier: Digikey; Supplier Part Number: 541-6.65MHCT-ND; Manufacturer Part Number: CRCW06036M65FKEA; RoHS: Yes; Category: Chip SMD Resistors; Stock: 29933; Pricing: 1=0.1, 10=0.026, 50=0.0166, 100=0.014, 500=0.00954, 1000=0.00824 (USD); Mounting Technology: Surface Mount; Pins: 2; Package Shape: Rectangular; Case/Package: 0603; Terminal Finish: Nickel; Min Operating Temperature: -55°C; Max Operating Temperature: 155°C; Tolerance: 1%; JESD-609 Code: e3; Resistor Type: FIXED RESISTOR; Construction: Chip; Package Style: SMTMeter; Packaging: Tape and Reel; Technology: METAL GLAZE/THICK FILM; Termination: Wraparound; Working Voltage: 75V; Reach SVHC Compliant: Yes; RoHS Compliant: Yes; ComponentLink1URL: https://datasheet.ciiva.com:443/pdfs/VipMasterIC/IC/VISH/VISH-S-A0007266705/VISH-S-A0007266705-1.pdf?src-supplier=IHS+Markit; ComponentLink1Description: https://datasheet.ciiva.com:443/pdfs/VipMasterIC/IC/VISH/VISH-S-A0007266705/VISH-S-A0007266705-1.pdf?src-supplier=IHS+Markit; ComponentLink2URL: https://datasheet.ciiva.com/2494/dcrcwe3-2494684.pdf?src-supplier=Digikey; ComponentLink2Description: https://datasheet.ciiva.com/2494/dcrcwe3-2494684.pdf?src-supplier=Digikey; ComponentLink3URL: https://datasheet.ciiva.com/2494/dcrcwe3-2494685.pdf?src-supplier=Digikey; ComponentLink3Description: https://datasheet.ciiva.com/2494/dcrcwe3-2494685.pdf?src-supplier=Digikey; ComponentLink4URL: https://datasheet.ciiva.com/2494/dcrcwe3-2494686.pdf?src-supplier=Digikey; ComponentLink4Description: https://datasheet.ciiva.com/2494/dcrcwe3-2494686.pdf?src-supplier=Digikey; ComponentLink5URL: https://datasheet.ciiva.com/9061/dcrcwe3-9061657.pdf?src-supplier=Avnet; ComponentLink5Description: https://datasheet.ciiva.com/9061/dcrcwe3-9061657.pdf?src-supplier=Avnet; ComponentLink6URL: https://datasheet.ciiva.com/7748/1697337-7748695.pdf?src-supplier=Element14; ComponentLink6Description: https://datasheet.ciiva.com/7748/1697337-7748695.pdf?src-supplier=Element14; ComponentLink7URL: https://datasheet.ciiva.com/7748/1697337-7748696.pdf?src-supplier=Element14; ComponentLink7Description: https://datasheet.ciiva.com/7748/1697337-7748696.pdf?src-supplier=Element14
R16 = CMP-2000-04067-1: Part Number: RC0603FR-074M75L; Manufacturer: Yageo; Tolerance: 1%; Additional Feature: LASER TRIMMABLE; Power: 100mW; Rated Temperature: 70°C; Value: 4.75MR; Temperature Coefficient: 100ppm/°C; Working Voltage: 75V; Package Height: 0.45mm; Package Length: 1.6mm; Package Width: 0.8mm; Supplier: Digikey; Supplier Part Number: 311-4.75MHRCT-ND; Manufacturer Part Number: RC0603FR-074M75L; RoHS: Yes; Category: Chip SMD Resistors; Stock: 37378; Pricing: 1=0.1, 10=0.019, 50=0.0112, 100=0.0093, 500=0.00622, 1000=0.00532 (USD); Mounting Technology: Surface Mount; Pins: 2; Package Shape: Rectangular; Case/Package: 0603; Terminal Finish: Nickel; Min Operating Temperature: -55°C; Max Operating Temperature: 155°C; JESD-609 Code: e3; Resistor Type: FIXED RESISTOR; Construction: Chip; Package Style: SMTMeter; Packaging: Tape and Reel; Technology: METAL GLAZE/THICK FILM; Termination: Wraparound; Reach SVHC Compliant: Yes; RoHS Compliant: Yes; ComponentLink1URL: https://datasheet.ciiva.com:443/pdfs/VipMasterIC/IC/YAGO/YAGO-S-A0008145938/YAGO-S-A0008145938-1.pdf?src-supplier=IHS+Markit; ComponentLink1Description: https://datasheet.ciiva.com:443/pdfs/VipMasterIC/IC/YAGO/YAGO-S-A0008145938/YAGO-S-A0008145938-1.pdf?src-supplier=IHS+Markit; ComponentLink2URL: https://datasheet.ciiva.com/2455/pyu-r-int-thick-7-2455038.pdf?src-supplier=Digikey; ComponentLink2Description: https://datasheet.ciiva.com/2455/pyu-r-int-thick-7-2455038.pdf?src-supplier=Digikey; ComponentLink3URL: https://datasheet.ciiva.com/2455/pyu-r-int-thick-7-2455039.pdf?src-supplier=Digikey; ComponentLink3Description: https://datasheet.ciiva.com/2455/pyu-r-int-thick-7-2455039.pdf?src-supplier=Digikey; ComponentLink4URL: https://datasheet.ciiva.com/2455/pyu-r-int-thick-7-2455040.pdf?src-supplier=Digikey; ComponentLink4Description: https://datasheet.ciiva.com/2455/pyu-r-int-thick-7-2455040.pdf?src-supplier=Digikey
R17 = CMP-02407-011800-1: RES Thick Film, 5.62MΩ, 1%, 0.1W, 100ppm/°C, 0603; Manufacturer: Vishay; Manufacturer Part Number: CRCW06035M62FKEA; Max Power Dissipation: 100mW; Resistance: 5.62MR; Voltage Rating (DC): 75V; Rated Temperature: 70°C; Value: 5.62MR; Package Height: 0.45mm; Package Length: 1.55mm; Package Width: 0.85mm; Reference Standard: AEC-Q200; Contact Plating: Tin; Temperature Coefficient: 100ppm/°C; Max Operating Temperature: 155°C; Case Code (Imperial): 0603; Width: 0.033inch; Depth: 0.85mm; Military Standard: Not; Lead Free: Lead Free; Length: 1.55mm; Features: Automotive AEC-Q200; Resistor Type: Thick Film; Case/Package: 0603; Construction: Rectangular; Number of Pins: 2; Power Rating: 100mW; Series: CRCW; Height: 0.02inch; Min Operating Temperature: -55°C; Case Code (Metric): 1608; Package Quantity: 10; RoHS Compliant: Yes; Packaging: Tape and Reel; Voltage Rating: 75V; Weight: 7.1E-05oz; Number of Terminations: 2; Resistance Tolerance: 1%; Tolerance: 1%; Supplier: Digikey; Supplier Part Number: 541-5.62MHCT-ND; RoHS: Yes; Category: Chip SMD Resistors; Stock: 11276; Pricing: 1=0.1, 10=0.027, 50=0.0166, 100=0.0138, 500=0.00932, 1000=0.00799 (USD); Mounting Technology: Surface Mount; Pins: 2; Package Shape: Rectangular; Terminal Finish: Nickel; JESD-609 Code: e3; Power: 100mW; Technology: METAL GLAZE/THICK FILM; Termination: Wraparound; Working Voltage: 75V; Reach SVHC Compliant: Yes; ComponentLink1URL: https://datasheet.ciiva.com:443/pdfs/VipMasterIC/IC/VISH/VISH-S-A0007266705/VISH-S-A0007266705-1.pdf?src-supplier=IHS+Markit; ComponentLink1Description: https://datasheet.ciiva.com:443/pdfs/VipMasterIC/IC/VISH/VISH-S-A0007266705/VISH-S-A0007266705-1.pdf?src-supplier=IHS+Markit; ComponentLink2URL: https://datasheet.ciiva.com/2525/dcrcwe3-2525254.pdf?src-supplier=Digikey; ComponentLink2Description: https://datasheet.ciiva.com/2525/dcrcwe3-2525254.pdf?src-supplier=Digikey; ComponentLink3URL: https://datasheet.ciiva.com/2525/dcrcwe3-2525255.pdf?src-supplier=Digikey; ComponentLink3Description: https://datasheet.ciiva.com/2525/dcrcwe3-2525255.pdf?src-supplier=Digikey; ComponentLink4URL: https://datasheet.ciiva.com/2525/dcrcwe3-2525256.pdf?src-supplier=Digikey; ComponentLink4Description: https://datasheet.ciiva.com/2525/dcrcwe3-2525256.pdf?src-supplier=Digikey; ComponentLink5URL: https://datasheet.ciiva.com/7748/1697337-7748679.pdf?src-supplier=Element14; ComponentLink5Description: https://datasheet.ciiva.com/7748/1697337-7748679.pdf?src-supplier=Element14; ComponentLink6URL: https://datasheet.ciiva.com/7748/1697337-7748680.pdf?src-supplier=Element14; ComponentLink6Description: https://datasheet.ciiva.com/7748/1697337-7748680.pdf?src-supplier=Element14; ComponentLink7URL: https://datasheet.ciiva.com/9065/dcrcwe3-9065258.pdf?src-supplier=Avnet; ComponentLink7Description: https://datasheet.ciiva.com/9065/dcrcwe3-9065258.pdf?src-supplier=Avnet; ComponentLink8URL: https://datasheet.ciiva.com/22700/1697337-22700634.pdf?src-supplier=Element14; ComponentLink8Description: https://datasheet.ciiva.com/22700/1697337-22700634.pdf?src-supplier=Element14; ComponentLink9URL: https://datasheet.ciiva.com/22675/1700796-22675468.pdf?src-supplier=Element14; ComponentLink9Description: https://datasheet.ciiva.com/22675/1700796-22675468.pdf?src-supplier=Element14; ComponentLink10URL: https://datasheet.ciiva.com/22675/1700796-22675469.pdf?src-supplier=Element14; ComponentLink10Description: https://datasheet.ciiva.com/22675/1700796-22675469.pdf?src-supplier=Element14; ComponentLink11URL: https://datasheet.ciiva.com/5546/dcrcwe3-109170-5546746.pdf?src-supplier=Mouser; ComponentLink11Description: https://datasheet.ciiva.com/5546/dcrcwe3-109170-5546746.pdf?src-supplier=Mouser
R18 = CMP-03412-018465-2: RES 4.99MΩ 1.00% 0.1W 0603; Manufacturer: Yageo; Manufacturer Part Number: RC0603FR-074M99L; Resistance: 4.99MR; Tolerance: 1%; Max Power Dissipation: 100mW; Temperature Coefficient: 100ppm/°C; Additional Feature: LASER TRIMMABLE; Rated Temperature: 70°C; Value: 4.99MR; Working Voltage: 75V; Package Height: 0.45mm; Package Length: 1.6mm; Package Width: 0.8mm; Resistor Type: Thick Film; Length: 0.063inch; Features: Moisture Resistant; Case/Package: 0603; Case Code (Metric): 1608; Ratings: AEC-Q200; Series: AC; Case Code (Imperial): 0603; RoHS Compliant: Yes; Min Operating Temperature: -55°C; Height: 0.022inch; Width: 0.031inch; Packaging: Tape and Reel; Number of Terminations: 2; Max Operating Temperature: 155°C; Supplier: Digikey; Supplier Part Number: 13-RC0603FR-074M99LCT-ND; RoHS: Yes; Category: Chip SMD Resistors; Stock: 585; Pricing: 1=0.1, 10=0.012, 50=0.0096, 100=0.0071, 500=0.00562, 1000=0.00408 (USD); Mounting Technology: Surface Mount; Pins: 2; Package Shape: Rectangular; Terminal Finish: Nickel; JESD-609 Code: e3; Construction: Chip; Package Style: SMTMeter; Power: 100mW; Technology: METAL GLAZE/THICK FILM; Termination: Wraparound; Reach SVHC Compliant: Yes; ComponentLink1URL: https://datasheet.ciiva.com:443/pdfs/VipMasterIC/IC/YAGO/YAGO-S-A0008145938/YAGO-S-A0008145938-1.pdf?src-supplier=IHS+Markit; ComponentLink1Description: https://datasheet.ciiva.com:443/pdfs/VipMasterIC/IC/YAGO/YAGO-S-A0008145938/YAGO-S-A0008145938-1.pdf?src-supplier=IHS+Markit; ComponentLink2URL: http://www.mouser.com/ds/2/447/RC0603-272842.pdf?src-supplier=Mouser; ComponentLink2Description: http://www.mouser.com/ds/2/447/RC0603-272842.pdf?src-supplier=Mouser; ComponentLink3URL: http://www.yageo.com/documents/recent/PYu-RC_Group_51_RoHS_L_9.pdf?src-supplier=Digikey; ComponentLink3Description: http://www.yageo.com/documents/recent/PYu-RC_Group_51_RoHS_L_9.pdf?src-supplier=Digikey; ComponentLink4URL: http://www.yageo.com/documents/recent/PYu-RC0603_51_RoHS_L_7.pdf?src-supplier=Future+Electronics; ComponentLink4Description: http://www.yageo.com/documents/recent/PYu-RC0603_51_RoHS_L_7.pdf?src-supplier=Future+Electronics; ComponentLink5URL: http://www.yageo.com/documents/recent/PYu-RC_Group_51_RoHS_L_2.pdf?src-supplier=Avnet; ComponentLink5Description: http://www.yageo.com/documents/recent/PYu-RC_Group_51_RoHS_L_2.pdf?src-supplier=Avnet; ComponentLink6URL: https://datasheet.octopart.com/RC0603FR-074M99L-Yageo-datasheet-164759695.pdf?src-supplier=Future+Electronics; ComponentLink6Description: https://datasheet.octopart.com/RC0603FR-074M99L-Yageo-datasheet-164759695.pdf?src-supplier=Future+Electronics; ComponentLink7URL: https://datasheet.octopart.com/RC0603FR-074M99L-Yageo-datasheet-148775077.pdf?src-supplier=TME; ComponentLink7Description: https://datasheet.octopart.com/RC0603FR-074M99L-Yageo-datasheet-148775077.pdf?src-supplier=TME
R20 R21 = CMP-2000-04091-1: Manufacturer: Yageo; Part Number: RC0603FR-075K1L; Tolerance: 1%; Additional Feature: LASER TRIMMABLE; Power: 100mW; Rated Temperature: 70°C; Value: 5.1kR; Temperature Coefficient: 100ppm/°C; Working Voltage: 75V; Package Height: 0.45mm; Package Length: 1.6mm; Package Width: 0.8mm; Supplier: Digikey; Supplier Part Number: 311-5.10KHRDKR-ND; Manufacturer Part Number: RC0603FR-075K1L; RoHS: Yes; Category: Chip SMD Resistors; Stock: 2006701; Pricing: 1=0.1, 10=0.012, 50=0.0096, 100=0.0071, 500=0.00612, 1000=0.0051 (USD); Mounting Technology: Surface Mount; Pins: 2; Package Shape: Rectangular; Case/Package: 0603; Terminal Finish: Nickel; Min Operating Temperature: -55°C; Max Operating Temperature: 155°C; JESD-609 Code: e3; Resistor Type: FIXED RESISTOR; Construction: Chip; Packaging: Tape and Reel; Technology: METAL GLAZE/THICK FILM; Termination: Wraparound; Reach SVHC Compliant: Yes; RoHS Compliant: Yes; ComponentLink1URL: https://datasheet.ciiva.com:443/pdfs/VipMasterIC/IC/YAGO/YAGO-S-A0008145938/YAGO-S-A0008145938-1.pdf?src-supplier=IHS+Markit; ComponentLink1Description: https://datasheet.ciiva.com:443/pdfs/VipMasterIC/IC/YAGO/YAGO-S-A0008145938/YAGO-S-A0008145938-1.pdf?src-supplier=IHS+Markit; ComponentLink2URL: https://datasheet.ciiva.com/46395/443971-46395016.pdf?src-supplier=Element14; ComponentLink2Description: https://datasheet.ciiva.com/46395/443971-46395016.pdf?src-supplier=Element14; ComponentLink3URL: https://datasheet.ciiva.com/2454/pyu-r-int-thick-7-2454045.pdf?src-supplier=Digikey; ComponentLink3Description: https://datasheet.ciiva.com/2454/pyu-r-int-thick-7-2454045.pdf?src-supplier=Digikey; ComponentLink4URL: https://datasheet.ciiva.com/2454/pyu-r-int-thick-7-2454046.pdf?src-supplier=Digikey; ComponentLink4Description: https://datasheet.ciiva.com/2454/pyu-r-int-thick-7-2454046.pdf?src-supplier=Digikey; ComponentLink5URL: https://datasheet.ciiva.com/2454/pyu-r-int-thick-7-2454047.pdf?src-supplier=Digikey; ComponentLink5Description: https://datasheet.ciiva.com/2454/pyu-r-int-thick-7-2454047.pdf?src-supplier=Digikey
U6 = BQ25570RGRT: Power Supply Support Circuit, Adjustable, 1 Channel, PQCC20; Manufacturer: Texas Instruments; Package Body Material: Plastic; Adjustable Threshold: Yes; Number of Channels: 1; Max Supply Voltage: 5.1V; Min Supply Voltage: 100mV; Supplier: Digikey; Supplier Part Number: 296-37014-1-ND; Manufacturer Part Number: BQ25570RGRT; RoHS: Yes; Category: Battery Management; Stock: 646; Pricing: 1=9.11, 10=6.836, 25=6.2676, 100=5.6427, 250=5.34468, 500=5.16496, 750=5.07495, 1250=4.97522, 1750=4.91693 (USD); Case/Package: HVQCCN; Pins: 20; Package Shape: Square; Terminal Finish: Nickel; Min Operating Temperature: -40°C; Max Operating Temperature: 85°C; JESD-609 Code: e4; Throw Configuration: POWER SUPPLY SUPPORT CIRCUIT; Moisture Sensitivity Level: 2; Channels: 1; Package Style: CHIP CARRIER, HEAT SINK/SLUG, VERY THIN PROFILEMeter; Peak Reflow Temperature (Cel): 260°C; Surface Mount: Yes; Terminal Form: No Lead; Terminal Position: QUAD; Length: 3.5mm; Width: 3.5mm; Height - Seated (Max): 1mm; Terminal Pitch: 0.5mm; Temperature Grade: INDUSTRIAL; Reach SVHC Compliant: Yes; RoHS Compliant: Yes; ComponentLink1URL: https://www.ti.com:443/lit/ds/symlink/bq25570.pdf?src-supplier=IHS+Markit; ComponentLink1Description: https://www.ti.com:443/lit/ds/symlink/bq25570.pdf?src-supplier=IHS+Markit; ComponentLink2URL: https://datasheet.ciiva.com/28483/1768287-28483478.pdf?src-supplier=Element14; ComponentLink2Description: https://datasheet.ciiva.com/28483/1768287-28483478.pdf?src-supplier=Element14; ComponentLink3URL: https://datasheet.ciiva.com/24110/slusbh2c-317150-24110945.pdf?src-supplier=Mouser; ComponentLink3Description: https://datasheet.ciiva.com/24110/slusbh2c-317150-24110945.pdf?src-supplier=Mouser; ComponentLink4URL: https://datasheet.ciiva.com/29590/bq25570-29590197.pdf?src-supplier=Digikey; ComponentLink4Description: https://datasheet.ciiva.com/29590/bq25570-29590197.pdf?src-supplier=Digikey; ComponentLink5URL: https://datasheet.ciiva.com/29590/bq25570-29590198.pdf?src-supplier=Digikey; ComponentLink5Description: https://datasheet.ciiva.com/29590/bq25570-29590198.pdf?src-supplier=Digikey; ComponentLink6URL: https://datasheet.ciiva.com/29892/bq25570-29892856.pdf?src-supplier=Avnet; ComponentLink6Description: https://datasheet.ciiva.com/29892/bq25570-29892856.pdf?src-supplier=Avnet; ComponentLink7URL: https://datasheet.ciiva.com/29892/bq25570-29892857.pdf?src-supplier=Avnet; ComponentLink7Description: https://datasheet.ciiva.com/29892/bq25570-29892857.pdf?src-supplier=Avnet